# Altium schematic sheet Coffee_printer PWR.SchDoc
size 420 x 297 mm; SheetNumber: 2; SheetTotal: 5; ProjectTitle: Prj name
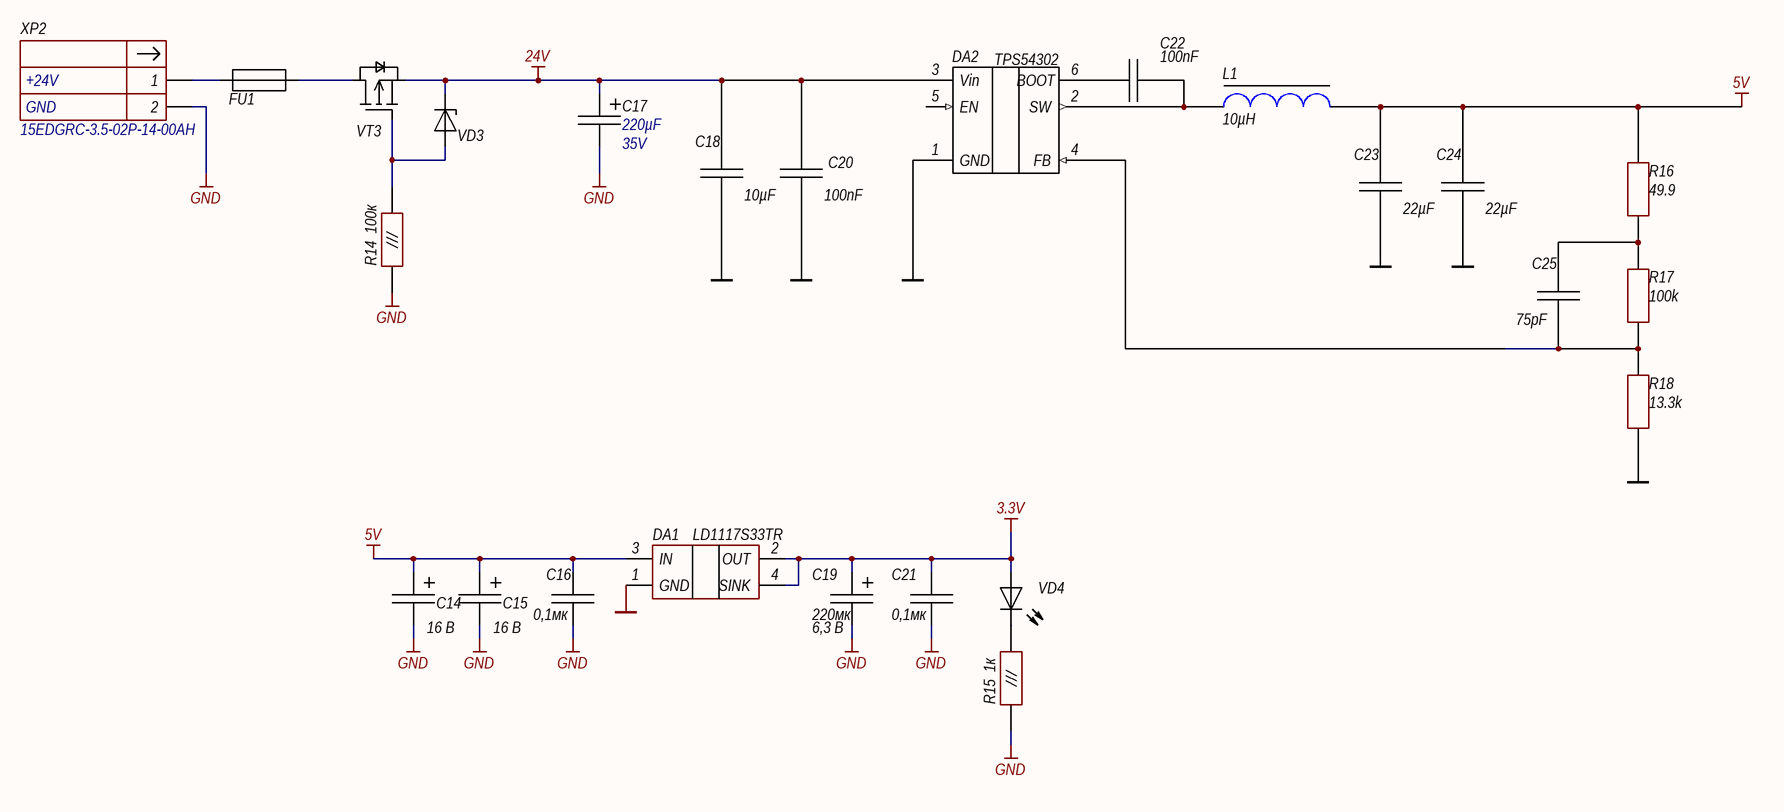
[diagram p0: Coffee_printer PWR.SchDoc]

## Parts
C14  voltage: 16 В  [CAPELSMD_D6.3_H5.5]  (hidden comment: 100мк)
C15  voltage: 16 В  [CAPELSMD_D6.3_H5.5]  (hidden comment: 100мк)
C16  0,1мк  [CAPC0805_H1.0_N]
C17  Capacitance: 220µF  Voltage Rating: 35V  [CAPELSMD_D8_H10.2]  (hidden comment: EEEFK1V221P)
C18  Capacitance: 10µF  [CAPC1210_H2.2_N]  (hidden comment: CL32B106KBJNFNE)
C19  220мк  voltage: 6,3 В  [CAPTAN_C_N]
C20  Capacitance: 100nF  [CAPC0603_H0.90_N]  (hidden comment: CC0603KRX7R7BB104)
C21  0,1мк  [CAPC0805_H1.0_N]
C22  Capacitance: 100nF  [CAPC0603_H0.90_N]  (hidden comment: CC0603KRX7R7BB104)
C23  Capacitance: 22µF  [CAPC1210_H2.2_N]  (hidden comment: CL32B226KAJNNNE)
C24  Capacitance: 22µF  [CAPC1210_H2.2_N]  (hidden comment: CL32B226KAJNNNE)
C25  Capacitance: 75pF  [CAPC0603_H0.90_N]  (hidden comment: CC0603JRNPO9BN750)
DA1  LD1117S33TR  [SOT-223]
DA2  TPS54302  [SOT-23-6]
FU1  0451001.MRL  [SMT_FUSE_451_453]  (value not drawn)
L1  Inductance: 10µH  [IHLP2525]  (hidden comment: IHLP2525CZER100M11)
R14  100к  [RESC0603_N]
R15  1к  [RESC0603_N]
R16  Resistance: 49.9  [RESC0603_N]  (hidden comment: RC0603FR-0749R9L)
R17  Resistance: 100k  [RESC0603_N]  (hidden comment: RC0603FR-07100KL)
R18  Resistance: 13.3k  [RESC0603_N]  (hidden comment: RC0603FR-0713K3L)
VD3  MMSZ12T1G  [SOD-123]  (value not drawn)
VD4  FYLS-0603UGC  [CH0603LG]  (value not drawn)
VT3  SI7617DN-T1-GE3  [PowerPAK 1212-8]  (value not drawn)
XP2  15EDGRC-3.5-02P-14-00AH  NET1: +24V  NET2: GND  [15EDGRC-3.5-02P-14-00AH]

## Nets
3.3V: C19.1 C21.1 DA1.2(OUT) DA1.4(SINK) VD4.1
5V: C14.1 C15.1 C16.1 C23.1 C24.1 DA1.3(IN) L1.2 R16.2
24V: C17.1 C18.1 C20.2 DA2.3(Vin) VD3.2 VT3.2(S)
GND: C14.2 C15.2 C16.2 C17.2 C18.2 C19.2 C20.1 C21.2 C23.2 C24.2 DA1.1(GND) DA2.1(GND) R14.1 R15.1 R18.1 XP2.2
NetC22_1: C22.1 DA2.6(BOOT)
NetC22_2: C22.2 DA2.2(SW) L1.1
NetC25_1: C25.1 R16.1 R17.2
NetC25_2: C25.2 DA2.4(FB) R17.1 R18.2
NetFU1_1: FU1.1 XP2.1
NetFU1_2: FU1.2 VT3.3(D)
NetR14_2: R14.2 VD3.1 VT3.1(G)
NetR15_2: R15.2 VD4.2

Not connected (* = marked no-connect by the designer): DA2 5(EN)

## Notes on the sheet
- Title:
- Author:
- Approved:
- Size:
- Date:
- Git Hash:
- A3
- Prj:
- Sheet
- of
- SW Version:
- Variant:
- Edited:
- CONFIDENTIAL
- File:

## Library data of the parts
C14 C15 = CA016M0100RED-0605_Yageo: CAP ALUM 100UF 20% 16V SMD; Manufacturer: Yageo; ValueBOM: Конденсатор CA016M0100RED-0605 "Yageo" (100 мкФ ± 20 %, 16 В SMD_D6.3_H5.5); Marking: 100 16V; Sorting: 100000000; Автор: Жегалов Сергей; Количество1: 1; Цена1: 0.0496; Количество2: 5000; Цена2: 0.0354; Разрешен к применению: True; Package_BOM: SMD_D6.3_H5.5; Type_BOM: Конденсатор; PartNumber: CA016M0100RED-0605_Yageo; HelpURL: http://www.yageo.com/documents/recent/E-Cap_SurfaceMount_CA_2011.pdf; ManufacturerPartNumber: CA016M0100RED-0605; ComponentLink3Description: Datasheet; Value: 100мк; Tolerance: ± 20 %; ComponentLink2Description: Manufacturer Link; ComponentLink2URL: http://www.yageo.com/; Operating Temperature: -40°C ~ +85°C; Modify: 19.11.2018 13:30:41; Supplier: Compel; Supplier P/N: CA016M0100RED-0605; Package Description: SMD D6.3mm, H5.5mm; ComponentLink4URL: https://sds.compel.ru/search?q=CA016M0100RED-0605; ComponentLink5URL: https://www.chipdip.by/search?searchtext=CA016M0100RED-0605; ComponentLink6URL: https://belchip.by/search_fuzzy/?query=CA016M0100RED-0605; ComponentLink4Description: Compel; ComponentLink5Description: Chip-Dip; ComponentLink6Description: Belchip; Package: CAPELSMD_D6.3_H5.5
C16 C21 = CC0805KPX7R9BB104_Yageo: CAPC 0.1uF 50V X7R SMD 0805; Manufacturer: Yageo; Tolerance: ± 10 %; Voltage: 50 В; ValueBOM: Конденсатор CC0805KPX7R9BB104 "Yageo" (0,1 мкФ ± 10 %, 50 В, X7R, SMD 0805); Modify: Чт, 15.11.2018 9:22:46; Sorting: 100000; Автор: Жегалов Сергей; Количество1: 1; Цена1: 0.0335; Количество2: 7800; Цена2: 0.0239; Разрешен к применению: True; Type_BOM: Конденсатор; PartNumber: CC0805KPX7R9BB104_Yageo; ManufacturerPartNumber: CC0805KPX7R9BB104; ComponentLink3Description: Datasheet; Value: 0,1мк; TKE: X7R; ComponentLink2Description: Manufacturer Link; ComponentLink2URL: http://www.yageo.com/; Operating Temperature: -55°C ~ +125°C; Supplier: Compel; Supplier P/N: CC0805KPX7R9BB104; Package Description: SMD 0805 H1.0mm; ComponentLink4URL: https://sds.compel.ru/search?q=CC0805KPX7R9BB104; ComponentLink5URL: https://www.chipdip.by/search?searchtext=CC0805KPX7R9BB104; ComponentLink6URL: https://belchip.by/search_fuzzy/?query=CC0805KPX7R9BB104; ComponentLink4Description: Compel; ComponentLink5Description: Chip-Dip; ComponentLink6Description: Belchip; Package: CAPC0805_H1.0; Package_BOM: SMD 0805; HelpURL: http://www.yageo.com/documents/recent/UPY-GPHC_X7R_6.3V-to-50V_18.pdf
C17 = CMP-CAP-EL-SMD-0047-1: 35V 220uF 105°C (8x10,2mm )2000Hours; Manufacturer: Panasonic; Dissipation Factor: 12%; ESR (Equivalent Series Resistance): 0.16; Leakage Current: 3µA; Ripple Current: 600mA; Tolerance: 20%; Author: M.S.Koval; Case/Package: Radial; Diameter: 8mm; Height: 10.2mm; HelpURL: https://b2b-api.panasonic.eu/file_stream/pids/fileversion/3127; Lead Free: Lead Free; Length: 10.2mm; Life (Hours): 2000Hour; Manufacturer Part Number: EEEFK1V221P; Max Operating Temperature: 105°C; Min Operating Temperature: -55°C; Series: FK
C18 = CMP-CAP-CER-SMD-0044-1: 10uF 10% X7R 50V 1210; Manufacturer: Samsung; Author: V.Kisel; Case Code (Imperial): 1210; Case Code (Metric): 3225; Case/Package: 1210; Dielectric: X7R; Height: 2.5mm; HelpURL: https://product.samsungsem.com/mlcc/CL32B106KBJNFN.do; Length: 3.2mm; Manufacturer Part Number: CL32B106KBJNFNE; Max Operating Temperature: 125°C; Min Operating Temperature: -55°C; Series: CL; Tolerance: 10%; Voltage Rating: 50V; Width: 2.5mm
C19 = 293D227X96R3C2TE3_Vishay Semiconductor: CAPTAN 220uF 10% 6.3V SMD_6032-28(size_C); ValueBOM: Конденсатор 293D227X96R3C2TE3 "Vishay Semiconductor" (220 мкФ ± 10 %, 6,3 В TANTAL_C); Modify: Ср, 21.11.2018 9:22:46; Sorting: 220000000; Автор: Жегалов Сергей; Количество1: 1; Цена1: 0.2982; Количество2: 2500; Цена2: 0.2024; Разрешен к применению: True; Package_BOM: TANTAL_C; Type_BOM: Конденсатор; PartNumber: 293D227X96R3C2TE3_Vishay Semiconductor; HelpURL: http://www.vishay.com/docs/40002/293d.pdf; Manufacturer: Vishay Semiconductor; ManufacturerPartNumber: 293D227X96R3C2TE3; ComponentLink3Description: Datasheet; Value: 220мк; Tolerance: ± 10 %; ComponentLink2Description: Manufacturer Link; ComponentLink2URL: http://www.vishay.com; Operating Temperature: -55°C ~ +125°C; Supplier: Compel; Supplier P/N: 293D227X96R3C2TE3; Package Description: TANTAL_C (6x3.2x2.5) code_6032-28; ComponentLink4URL: https://sds.compel.ru/search?q=293D227X96R3C2TE3; ComponentLink5URL: https://www.chipdip.by/search?searchtext=293D227X96R3C2TE3; ComponentLink6URL: https://belchip.by/search_fuzzy/?query=293D227X96R3C2TE3; ComponentLink4Description: Compel; ComponentLink5Description: Chip-Dip; ComponentLink6Description: Belchip; Package: CAPTAN_C
C20 C22 = CMP-CAP-CER-SMD-0036-2: 0.1uF 10% X7R 16V 0603; Manufacturer: Yageo; Length: 1.6mm; Min Operating Temperature: -55°C; Case Code (Metric): 1608; Case Code (Imperial): 0603; Author: v.ivanchenko; Tolerance: 10%; Case/Package: 0603; Depth: 800µm; Manufacturer Part Number: CC0603KRX7R7BB104; HelpURL: https://www.yageo.com/upload/media/product/products/datasheet/mlcc/UPY-GPHC_X7R_6.3V-to-50V_20.pdf; Max Operating Temperature: 125°C; Voltage Rating: 16V; Lead Free: Lead Free; Height: 800µm; Dielectric: X7R; Series: CC
C23 C24 = CMP-CAP-CER-SMD-0043-1: Ceramic capacitor SMD-1210 22000nF (22uF) /25V X7R# K +- 10% Samsung, RoHS/4k/; Dielectric: X7R; Voltage Rating: 25V; Author: V.Kisel; Case Code (Imperial): 1210; Case Code (Metric): 3225; Case/Package: 1210; Depth: 2.5mm; Height: 2.5mm; HelpURL: https://weblib.samsungsem.com/mlcc/mlcc-ec-data-sheet.do?partNumber=CL32B226KAJNNN; Lead Free: Lead Free; Length: 3.2mm; Manufacturer: Samsung; Manufacturer Part Number: CL32B226KAJNNNE; Max Operating Temperature: 125°C; Min Operating Temperature: -55°C; Series: CL; Tolerance: 10%; Width: 2.5mm
C25 = CMP-CAP-CER-SMD-0042-1: 0603 75 pF 50 V ±5 % Tolerance NP0 SMT Multilayer Ceramic Capacitor; Manufacturer: Yageo; Tolerance: 5%; Voltage Rating: 50V; Length: 1.6mm; Min Operating Temperature: -55°C; Case Code (Metric): 1608; Case Code (Imperial): 0603; Author: V.Kisel; Case/Package: 0603; Depth: 800µm; Manufacturer Part Number: CC0603JRNPO9BN750; HelpURL: https://www.yageo.com/upload/media/product/products/datasheet/mlcc/UPY-GPHC_X7R_6.3V-to-50V_20.pdf; Max Operating Temperature: 125°C; Width: 800µm; Lead Free: Lead Free; Height: 800µm; Dielectric: NP0; Series: CC
DA1 = LD1117S33TR_STMicroelectronics: DA LD1117S33TR REG LINEAR 3.3V 800MA SOT223; ValueBOM: Микросхема  LD1117S33TR "STMicroelectronics" SOT-223; Modify: Пн, 26.11.2018 11:39:06; Автор: Дёмин Виктор; Количество1: 1; Цена1: 0.16; Количество2: 5000; Цена2: 0.1; Разрешен к применению: True; SMD mounting: False; Type_BOM: Микросхема; PartNumber: LD1117S33TR_STMicroelectronics; HelpURL: http://www.st.com/content/ccc/resource/technical/document/datasheet/99/3b/7d/91/91/51/4b/be/CD00000544.pdf/files/CD00000544.pdf/jcr:content/translations/en.CD00000544.pdf; ManufacturerPartNumber: LD1117S33TR; Manufacturer: STMicroelectronics; ComponentLink4URL: https://sds.compel.ru/search?q=LD1117S33TR; ComponentLink5URL: https://www.chipdip.by/search?searchtext=LD1117S33TR; ComponentLink6URL: https://belchip.by/search_fuzzy/?query=LD1117S33TR; ComponentLink4Description: Compel; ComponentLink5Description: Chip-Dip; ComponentLink6Description: Belchip; ComponentLink3Description: Datasheet; Value: LD1117S33TR; ComponentLink2Description: Manufacturer Link; ComponentLink2URL: http://www.st.com; Supplier: Compel; Supplier P/N: LD1117S33TR; Package Description: SOT-223; Package: SOT-223; Package_BOM: SOT-223
DA2 = CMP-IC-POW_MGMT-SVR0002-1: 4.5-V to 28-V Input, 3-A Output, EMI Friendly Synchronous Step-Down Converter; Manufacturer: Texas Instruments; Max Input Voltage: 28V; Max Output Current: 3A; Min Input Voltage: 4.5V; Min Output Voltage: 600mV; Output Configuration: Positive; Output Type: Adjustable; Quiescent Current: 45µA; Switching Frequency: 400kHz; Synchronous Rectifier: Yes; Author: V.Kisel; HelpUrl: https://datasheet.lcsc.com/lcsc/1810181611_Texas-Instruments-TPS54302DDCT_C129370.pdf; Manufacturer Part Number: TPS54302; Max Operating Temperature: 125°C; Max Output Voltage: 28V; Min Operating Temperature: -40°C; Mount: Surface mount; Output Current: 3A
FU1 = 0451001.MRL_Littelfuse: FU_0451001.MRL 1A 125V FUSE SMT; Voltage: 125 В; ValueBOM: 0451001.MRL EIA RS-481-2; Автор: Касперович Андрей; Количество1: 1; Цена1: 0,279; Количество2: 1000; Разрешен к применению: True; Package_BOM: EIA RS-481-2; Type_BOM: Разное; HelpURL: https://www.littelfuse.com/~/media/electronics/datasheets/fuses/littelfuse_fuse_451_453_datasheet.pdf.pdf; PartNumber: 0451001.MRL_Littelfuse; ManufacturerPartNumber: 0451001.MRL; Manufacturer: Littelfuse; Value: 0451001.MRL; Current: 1A; Marking: 1A; ComponentLink3Description: Datasheet; Modify: 01.04.2019 11:07:42; Supplier: Compel; Supplier P/N: 0451001.MRL; Package: SMT6.1X2.7; Цена2: 0,279; ВП: 0451001.MRL EIA RS-481-2; ComponentLink4URL: https://sds.compel.ru/search?q=0451001.MRL; ComponentLink5URL: https://www.chipdip.by/search?searchtext=0451001.MRL; ComponentLink6URL: https://belchip.by/search_fuzzy/?query=0451001.MRL; ComponentLink4Description: Compel; ComponentLink5Description: Chip-Dip; ComponentLink6Description: Belchip; Package Description: Surface Mount Fuses / NANO2® > Very Fast-Acting > 451/453 Series; SMD mounting: True; ComponentLink1Description: Supplier; ComponentLink1URL: http://www.compel.ru; ComponentLink2Description: Manufacturer Link; ComponentLink2URL: http://www.littelfuse.com/; Type: XXX
L1 = CMP-IND-0020-1: SMD2525 10uH 4A/3.5A 50V 71.2 mOhm; Manufacturer: Vishay; DC Resistance (DCR): 71.2m; Max DC Current: 4A; Saturation Current: 3.5A; Self Resonant Frequency: 18MHz; Tolerance: 20%; Author: V.Kisel; Case/Package: 2525; Depth: 6.72mm; Height: 3mm; HelpURL: https://www.vishay.com/docs/34190/ihlp-2525cz-11.pdf; Lead Free: Yes; Length: 6.5mm; Manufacturer Part Number: IHLP2525CZER100M11; Max Operating Temperature: 125°C; Min Operating Temperature: -55°C; Mount: Surface Mount; RMS Current (Irms): 4A; RoHS Compliant: Yes; Series: IHLP; Width: 6.5mm
R14 = RC0603FR-07100KL_Yageo: RES 100K SMD 0603 1%; Manufacturer: Yageo; Power: 0,1 Вт; ValueBOM: Резистор RC0603FR-07100KL "Yageo" (100 кОм ± 1 %, 0,1 Вт SMD 0603); ТКС: ±100ppm/C°; Sorting: 100000; Автор: Анципов Антон; Количество1: 1; Цена1: 0; Количество2: 10000; Разрешен к применению: True; ВП: Резистор RC0603FR-07100KL (100 кОм ± 1 %, 0,1 Вт SMD 0603); Type_BOM: Резистор; HelpURL: http://yageo.ru/pdf/RC0603.pdf; PartNumber: RC0603FR-07100KL_Yageo; ManufacturerPartNumber: RC0603FR-07100KL; Value: 100к; Tolerance: ± 1 %; Operating Temperature: -55°C ~ +155°C; ComponentLink3Description: Datasheet; Modify: 22.10.2018 18:51:35; Supplier: Compel; Supplier P/N: RC0603FR-07100KL; Package: RESC0603; Цена2: 0; ComponentLink4URL: https://sds.compel.ru/search?q=RC0603FR-07100KL; ComponentLink5URL: https://www.chipdip.by/search?searchtext=RC0603FR-07100KL; ComponentLink6URL: https://belchip.by/search_fuzzy/?query=RC0603FR-07100KL; ComponentLink4Description: Compel; ComponentLink5Description: Chip-Dip; ComponentLink6Description: Belchip; Package_BOM: SMD 0603; Package Description: SMD 0603; SMD mounting: True; ComponentLink1Description: Supplier; ComponentLink1URL: http://www.compel.ru; ComponentLink2Description: Manufacturer Link; ComponentLink2URL: http://www.yageo.com/; Type: R
R15 = RC0603FR-071KL_Yageo: RES 1k SMD 0603 1%; Manufacturer: Yageo; Power: 0,1 Вт; ValueBOM: Резистор RC0603FR-071KL "Yageo" (1 кОм ± 1 %, 0,1 Вт SMD 0603); ТКС: ±100ppm/C°; Sorting: 1000; Автор: Анципов Антон; Количество1: 1; Цена1: 0; Количество2: 10000; Разрешен к применению: True; Type_BOM: Резистор; PartNumber: RC0603FR-071KL_Yageo; HelpURL: http://yageo.ru/pdf/RC0603.pdf; ManufacturerPartNumber: RC0603FR-071KL; ComponentLink3Description: Datasheet; Value: 1к; Tolerance: ± 1 %; ComponentLink2Description: Manufacturer Link; ComponentLink2URL: http://www.yageo.com/; Operating Temperature: -55°C ~ +155°C; Modify: 22.10.2018 18:51:35; Supplier: Compel; Supplier P/N: RC0603FR-071KL; Package Description: SMD 0603; Цена2: 0; Package: RESC0603; Type: R; ComponentLink4URL: https://sds.compel.ru/infosheet/YAG/RC0603FR-071KL; ComponentLink5URL: https://www.chipdip.by/catalog/smd-resistors?gq=RC0603FR-071KL; ComponentLink6URL: https://belchip.by/product/?selected_product=19295; ComponentLink4Description: Compel; ComponentLink5Description: Chip-Dip; ComponentLink6Description: Belchip; Package_BOM: SMD 0603
R16 = CMP-RES-SMD-0963-1: Res General Purpose Thick Film 0603 49.9 Ohm 1% 1/10W ±100ppm/°C Molded SMD Paper T/R; Manufacturer: Yageo; Max Power Dissipation: 100mW; Voltage Rating: 75V; Author: V.Kisel; Case/Package: 0603; Manufacturer Part Number: RC0603FR-0749R9L; Max Operating Temperature: 155°C; Min Operating Temperature: -55°C; Temperature Coefficient: 100ppm/°C; Tolerance: 1%
R17 = CMP-RES-SMD-0462-2: RES SMD 100 KOHM 1% 1/10W 0603; Manufacturer: Yageo; Max Power Dissipation: 100mW; Temperature Coefficient: ±100ppm/C°; Voltage Rating: 75V; Author: M.S. Koval; Case/Package: 0603; HelpURL: https://www.yageo.com/upload/media/product/productsearch/datasheet/rchip/PYu-RC_Group_51_RoHS_L_11.pdf; Manufacturer Part Number: RC0603FR-07100KL; Max Operating Temperature: 155°C; Min Operating Temperature: -55°C; Tolerance: 1%
R18 = CMP-RES-SMD-0441-2: RES SMD 13.3K OHM 1% 1/10W 0603; Manufacturer: Yageo; Max Power Dissipation: 100mW; Temperature Coefficient: 100ppm/°C; Voltage Rating: 75V; Author: M.S. Koval; Case/Package: 0603; HelpURL: https://www.yageo.com/upload/media/product/productsearch/datasheet/rchip/PYu-RC_Group_51_RoHS_L_11.pdf; Manufacturer Part Number: RC0603FR-0713K3L; Max Operating Temperature: 155°C; Min Operating Temperature: -55°C; Tolerance: 1%
VD3 = MMSZ12T1G_ON Semiconductor: Zener diode 500mW 12V  ±5% SOD-123; ValueBOM: Стабилитрон MMSZ12T1G "ON Semiconductor" SOD-123; Marking: СС4; Voltage: 12 В; Автор: Касперович Андрей; Количество1: 1; Цена1: 0.0183; Количество2: 10000; Цена2: 0.0131; Разрешен к применению: True; ВП: Стабилитрон MMSZ12T1G; Type_BOM: Диод; PartNumber: MMSZ12T1G_ON Semiconductor; HelpURL: https://www.onsemi.com/pub/Collateral/MMSZ5221ET1-D.PDF; ManufacturerPartNumber: MMSZ12T1G; Manufacturer: ON Semiconductor; ComponentLink3Description: Datasheet; Value: MMSZ12T1G; ComponentLink2Description: Manufacturer Link; ComponentLink2URL: http://www.onsemi.ru.com/; Operating Temperature: -65°C ~ +150°C; Modify: 01.04.2019 9:10:20; Supplier: Compel; Supplier P/N: MMSZ12T1G; Package Description: SOD-123; ComponentLink4URL: https://sds.compel.ru/search?q=MMSZ12T1G; ComponentLink5URL: https://www.chipdip.by/search?searchtext=MMSZ12T1G; ComponentLink6URL: https://belchip.by/search_fuzzy/?query=MMSZ12T1G; ComponentLink4Description: Compel; ComponentLink5Description: Chip-Dip; ComponentLink6Description: Belchip; Package_BOM: SOD-123
VD4 = FYLS-0603UGC_Foryard Optoelectronics: VD FYLS-0603UGC LED GREEN 20mA 2V SMD 0603; ValueBOM: Диод FYLS-0603UGC "Foryard Optoelectronics" CH0603; Modify: Пн, 14.01.2019 13:57:40; Voltage: 2 В; Автор: Коваль Максим; Количество1: 1; Цена1: 0.0450; Количество2: 16000; Цена2: 0.0306; Разрешен к применению: True; ВП: Диод FYLS-0603UGC CH0603; Package_BOM: CH0603; Type_BOM: Диод; PartNumber: FYLS-0603UGC_Foryard Optoelectronics; HelpURL: http://www.foryard-led.ru/pdf/fyls-0603ugc.pdf; ManufacturerPartNumber: FYLS-0603UGC; Manufacturer: Foryard Optoelectronics; ComponentLink3Description: Datasheet; Value: FYLS-0603UGC; ComponentLink2Description: Manufacturer Link; ComponentLink2URL: http://foryard.com; Operating Temperature: -40°C ~ +85°C; Supplier: Compel; Supplier P/N: FYLS-0603UGC; Package Description: LED 0603 GREEN; ComponentLink4URL: https://sds.compel.ru/search?q=FYLS-0603UGC; ComponentLink5URL: https://www.chipdip.by/search?searchtext=FYLS-0603UGC; ComponentLink6URL: https://belchip.by/search_fuzzy/?query=FYLS-0603UGC; ComponentLink4Description: Compel; ComponentLink5Description: Chip-Dip; ComponentLink6Description: Belchip
VT3 = CMP-DISCRETE-TRANSISTORS-MOSFET0007-1: MOSFET P-CH 30V 35A 1212-8 PPAK; Manufacturer Part Number: Si7615ADN; Manufacturer: Vishay; Power Dissipation: 3.7W; Rds ON Max: 4.4m; Drain to Source Voltage Vds: -30V; Continuous Drain Current ID: -35A; Theshold Voltage Vgth: -1.5V; Input Capacitance: 1.8nF; Gate to source voltage: 12V; Author: m.seliadtsou; Mount: Surface Mount; HelpUrl: https://www.vishay.com/docs/62667/si7615adn.pdf; Type: P-ch
XP2 = CMP-CON-TBLOCK-0010-3: 2 pin, 3.5mm, 8A, 250V; Manufacturer: Degson; Gender: Female; Number of Contacts: 2; Number of Levels: 1; Author: a.antipov; Color: Green; Contact Gender: Male; Contact Material: Brass, Tin; Contact Plating: Tin; Current Rating: 8A; HelpURL: http://files.клеммник.рф/pdf/15edgrc-3.5.pdf; Housing Color: Green; Housing Material: PA66, UL94V-0; Manufacturer Part Number: 15EDGRC-3.5-02P-14-00AH; Max Current Rating: 8A; Max Operating Temperature: 105°C; Min Operating Temperature: -40°C; Mount: Through Hole; Orientation: Horizontal; Pitch: 3.5mm; Series: 15EDGRC; Termination: Solder; Voltage Rating: 250V